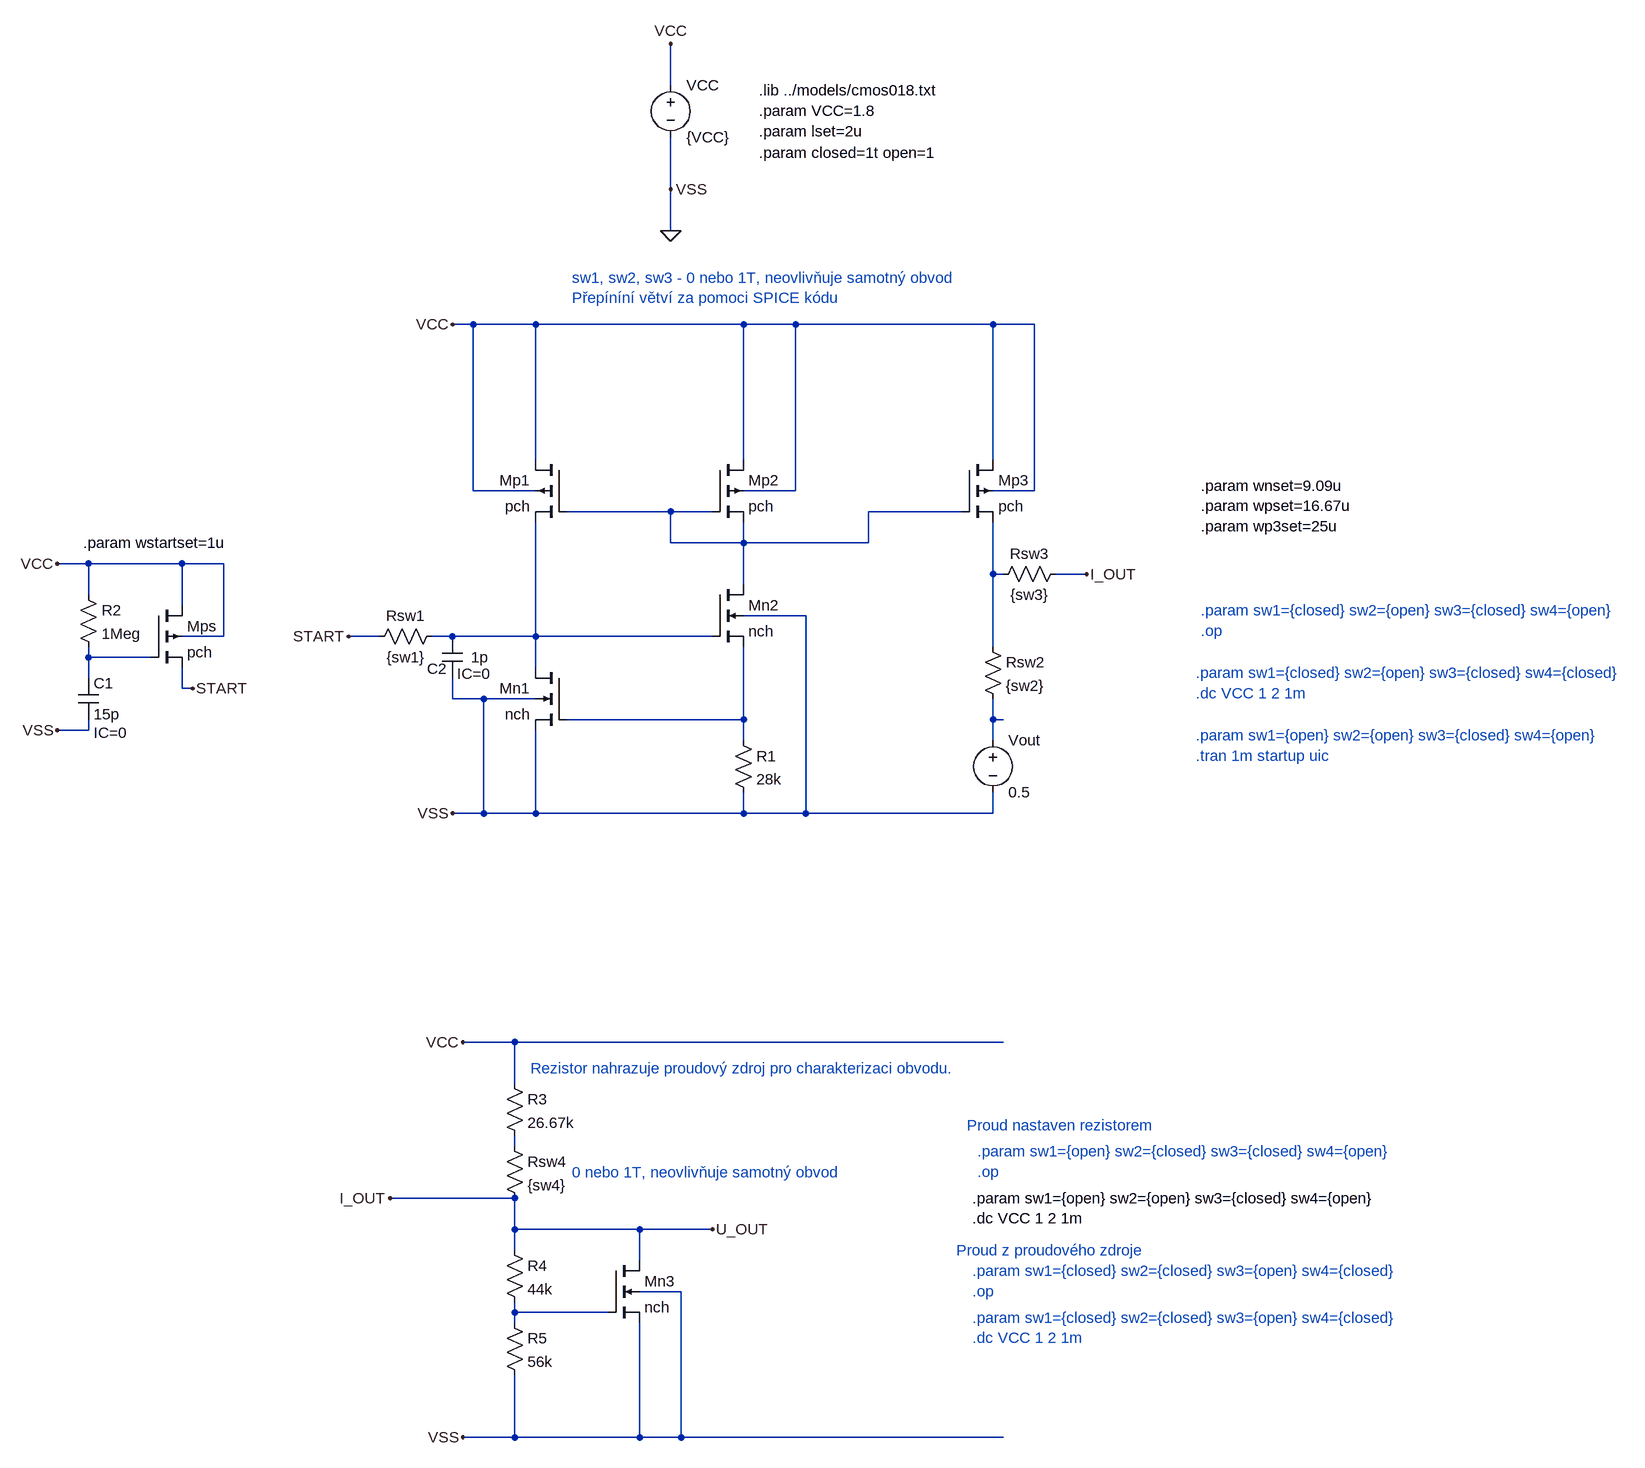
[diagram p0: schematic 3.asc]
3.asc, the LTspice schematic file:
Version 4
SHEET 1 2972 2004
WIRE 1072 -544 1072 -608
WIRE 1072 -384 1072 -464
WIRE 1072 -320 1072 -384
WIRE 768 -176 736 -176
WIRE 864 -176 768 -176
WIRE 1184 -176 864 -176
WIRE 1264 -176 1184 -176
WIRE 1568 -176 1264 -176
WIRE 1632 -176 1568 -176
WIRE 864 32 864 -176
WIRE 1184 32 1184 -176
WIRE 1568 32 1568 -176
WIRE 768 80 768 -176
WIRE 864 80 768 80
WIRE 1264 80 1264 -176
WIRE 1264 80 1184 80
WIRE 1632 80 1632 -176
WIRE 1632 80 1568 80
WIRE 1072 112 912 112
WIRE 1136 112 1072 112
WIRE 1520 112 1376 112
WIRE 1072 160 1072 112
WIRE 1184 160 1184 128
WIRE 1184 160 1072 160
WIRE 1376 160 1376 112
WIRE 1376 160 1184 160
WIRE 176 192 128 192
WIRE 320 192 176 192
WIRE 384 192 320 192
WIRE 1568 208 1568 128
WIRE 1584 208 1568 208
WIRE 1712 208 1664 208
WIRE 1184 224 1184 160
WIRE 176 240 176 192
WIRE 320 256 320 192
WIRE 1280 272 1184 272
WIRE 384 304 384 192
WIRE 384 304 320 304
WIRE 624 304 576 304
WIRE 736 304 704 304
WIRE 864 304 864 128
WIRE 864 304 736 304
WIRE 1136 304 864 304
WIRE 1568 320 1568 208
WIRE 176 336 176 320
WIRE 272 336 176 336
WIRE 864 352 864 304
WIRE 176 368 176 336
WIRE 320 384 320 352
WIRE 336 384 320 384
WIRE 736 400 736 368
WIRE 784 400 736 400
WIRE 864 400 784 400
WIRE 1184 432 1184 320
WIRE 1184 432 912 432
WIRE 1568 432 1568 400
WIRE 1584 432 1568 432
WIRE 176 448 176 432
WIRE 176 448 128 448
WIRE 1184 464 1184 432
WIRE 1568 464 1568 432
WIRE 784 576 784 400
WIRE 784 576 736 576
WIRE 864 576 864 448
WIRE 864 576 784 576
WIRE 1184 576 1184 544
WIRE 1184 576 864 576
WIRE 1280 576 1280 272
WIRE 1280 576 1184 576
WIRE 1568 576 1568 544
WIRE 1568 576 1280 576
WIRE 832 928 752 928
WIRE 1584 928 832 928
WIRE 832 992 832 928
WIRE 832 1088 832 1072
WIRE 832 1168 640 1168
WIRE 832 1216 832 1168
WIRE 1024 1216 832 1216
WIRE 1136 1216 1024 1216
WIRE 832 1248 832 1216
WIRE 1024 1264 1024 1216
WIRE 1088 1312 1024 1312
WIRE 832 1344 832 1328
WIRE 976 1344 832 1344
WIRE 832 1360 832 1344
WIRE 832 1536 832 1440
WIRE 832 1536 752 1536
WIRE 1024 1536 1024 1360
WIRE 1024 1536 832 1536
WIRE 1088 1536 1088 1312
WIRE 1088 1536 1024 1536
WIRE 1584 1536 1088 1536
FLAG 1072 -320 0
FLAG 1072 -608 VCC
FLAG 736 -176 VCC
FLAG 736 576 VSS
FLAG 1072 -384 VSS
FLAG 576 304 START
FLAG 128 192 VCC
FLAG 128 448 VSS
FLAG 336 384 START
FLAG 1712 208 I_OUT
FLAG 752 928 VCC
FLAG 752 1536 VSS
FLAG 1136 1216 U_OUT
FLAG 640 1168 I_OUT
DATAFLAG 1184 432 ""
DATAFLAG 1584 432 ""
DATAFLAG 864 -64 "Id(Mp1)"
DATAFLAG 1184 -64 "Id(Mp2)"
DATAFLAG 1568 -64 "Id(Mp3)"
DATAFLAG 912 1344 ""
DATAFLAG 1024 1216 ""
DATAFLAG 976 1040 "I(R3)"
DATAFLAG 736 1168 "I(Rsw3)"
SYMBOL voltage 1072 -560 R0
WINDOW 123 0 0 Left 0
WINDOW 39 0 0 Left 0
SYMATTR InstName VCC
SYMATTR Value {VCC}
SYMBOL pmos4 912 32 M0
SYMATTR InstName Mp1
SYMATTR Value pch
SYMATTR Value2 l=lset w=wpset
SYMBOL pmos4 1136 32 R0
SYMATTR InstName Mp2
SYMATTR Value pch
SYMATTR Value2 l=lset w=wpset
SYMBOL pmos4 1520 32 R0
SYMATTR InstName Mp3
SYMATTR Value pch
SYMATTR Value2 l=lset w=wp3set
SYMBOL nmos4 912 352 M0
SYMATTR InstName Mn1
SYMATTR Value nch
SYMATTR Value2 l=lset w=wnset
SYMBOL nmos4 1136 224 R0
SYMATTR InstName Mn2
SYMATTR Value nch
SYMATTR Value2 l=lset w=wnset
SYMBOL res 1168 448 R0
SYMATTR InstName R1
SYMATTR Value 28k
SYMBOL cap 160 368 R0
WINDOW 123 24 84 Left 2
SYMATTR Value2 IC=0
SYMATTR InstName C1
SYMATTR Value 15p
SYMBOL res 160 224 R0
SYMATTR InstName R2
SYMATTR Value 1Meg
SYMBOL pmos4 272 256 R0
SYMATTR InstName Mps
SYMATTR Value pch
SYMATTR Value2 l=lset w=wstartset
SYMBOL voltage 1568 448 R0
SYMATTR InstName Vout
SYMATTR Value 0.5
SYMBOL res 816 976 R0
SYMATTR InstName R3
SYMATTR Value 26.67k
SYMBOL res 720 288 R90
WINDOW 0 0 56 VBottom 2
WINDOW 3 32 56 VTop 2
SYMATTR InstName Rsw1
SYMATTR Value {sw1}
SYMBOL res 1552 304 R0
SYMATTR InstName Rsw2
SYMATTR Value {sw2}
SYMBOL res 1568 224 R270
WINDOW 0 32 56 VTop 2
WINDOW 3 0 56 VBottom 2
SYMATTR InstName Rsw3
SYMATTR Value {sw3}
SYMBOL res 816 1072 R0
SYMATTR InstName Rsw4
SYMATTR Value {sw4}
SYMBOL res 816 1232 R0
SYMATTR InstName R4
SYMATTR Value 44k
SYMBOL res 816 1344 R0
SYMATTR InstName R5
SYMATTR Value 56k
SYMBOL nmos4 976 1264 R0
SYMATTR InstName Mn3
SYMATTR Value nch
SYMATTR Value2 l=lset w=wnset
SYMBOL cap 720 304 R0
WINDOW 0 -23 50 Left 2
WINDOW 3 45 32 Left 2
WINDOW 123 23 57 Left 2
SYMATTR InstName C2
SYMATTR Value 1p
SYMATTR Value2 IC=0
TEXT 1208 -536 Left 2 !.lib ../models/cmos018.txt\n.param VCC=1.8\n.param lset=2u
TEXT 1880 360 Left 2 ;.param sw1={closed} sw2={open} sw3={closed} sw4={closed}\n.dc VCC 1 2 1m
TEXT 1888 72 Left 2 !.param wnset=9.09u \n.param wpset=16.67u\n.param wp3set=25u
TEXT 856 968 Left 2 ;Rezistor nahrazuje proudový zdroj pro charakterizaci obvodu.
TEXT 920 1128 Left 2 ;0 nebo 1T, neovlivňuje samotný obvod
TEXT 920 -248 Left 2 ;sw1, sw2, sw3 - 0 nebo 1T, neovlivňuje samotný obvod\nPřepíníní větví za pomoci SPICE kódu
TEXT 168 160 Left 2 !.param wstartset=1u
TEXT 1208 -440 Left 2 !.param closed=1t open=1
TEXT 1888 264 Left 2 ;.param sw1={closed} sw2={open} sw3={closed} sw4={open}\n.op
TEXT 1880 456 Left 2 ;.param sw1={open} sw2={open} sw3={closed} sw4={open}\n.tran 1m startup uic
TEXT 1544 1096 Left 2 ;.param sw1={open} sw2={closed} sw3={closed} sw4={open}\n.op
TEXT 1536 1168 Left 2 !.param sw1={open} sw2={open} sw3={closed} sw4={open}\n.dc VCC 1 2 1m
TEXT 1528 1056 Left 2 ;Proud nastaven rezistorem
TEXT 1512 1248 Left 2 ;Proud z proudového zdroje
TEXT 1536 1280 Left 2 ;.param sw1={closed} sw2={closed} sw3={open} sw4={closed}\n.op
TEXT 1536 1352 Left 2 ;.param sw1={closed} sw2={closed} sw3={open} sw4={closed}\n.dc VCC 1 2 1m

The netlist it stands for:
* 3.asc
VCC VCC 0 {VCC}
Mp1 VCC N001 N003 VCC pch l=lset w=wpset
Mp2 VCC N001 N001 VCC pch l=lset w=wpset
Mp3 VCC N001 N002 VCC pch l=lset w=wp3set
Mn1 N003 N005 0 0 nch l=lset w=wnset
Mn2 N001 N003 N005 0 nch l=lset w=wnset
R1 N005 0 28k
C1 N004 0 15p IC=0
R2 VCC N004 1Meg
Mps VCC N004 START VCC pch l=lset w=wstartset
Vout N006 0 0.5
R3 VCC N007 26.67k
Rsw1 N003 START {sw1}
Rsw2 N002 N006 {sw2}
Rsw3 N002 U_OUT {sw3}
Rsw4 N007 U_OUT {sw4}
R4 U_OUT N008 44k
R5 N008 0 56k
Mn3 U_OUT N008 0 0 nch l=lset w=wnset
C2 N003 0 1p IC=0
.model NMOS NMOS
.model PMOS PMOS
.lib standard.mos
.lib ../models/cmos018.txt
.param VCC=1.8
.param lset=2u
* .param sw1={closed} sw2={open} sw3={closed} sw4={closed}
* .dc VCC 1 2 1m
.param wnset=9.09u
.param wpset=16.67u
.param wp3set=25u
* Rezistor nahrazuje proudový zdroj pro charakterizaci obvodu.
* 0 nebo 1T, neovlivňuje samotný obvod
* sw1, sw2, sw3 - 0 nebo 1T, neovlivňuje samotný obvod
* Přepíníní větví za pomoci SPICE kódu
.param wstartset=1u
.param closed=1t open=1
* .param sw1={closed} sw2={open} sw3={closed} sw4={open}
* .op
* .param sw1={open} sw2={open} sw3={closed} sw4={open}
* .tran 1m startup uic
* .param sw1={open} sw2={closed} sw3={closed} sw4={open}
* .op
.param sw1={open} sw2={open} sw3={closed} sw4={open}
.dc VCC 1 2 1m
* Proud nastaven rezistorem
* Proud z proudového zdroje
* .param sw1={closed} sw2={closed} sw3={open} sw4={closed}
* .op
* .param sw1={closed} sw2={closed} sw3={open} sw4={closed}
* .dc VCC 1 2 1m
.backanno
.end